# EAGLE design CS42436 Eval (EAGLE 6.3)

## Sheet 1 of 2
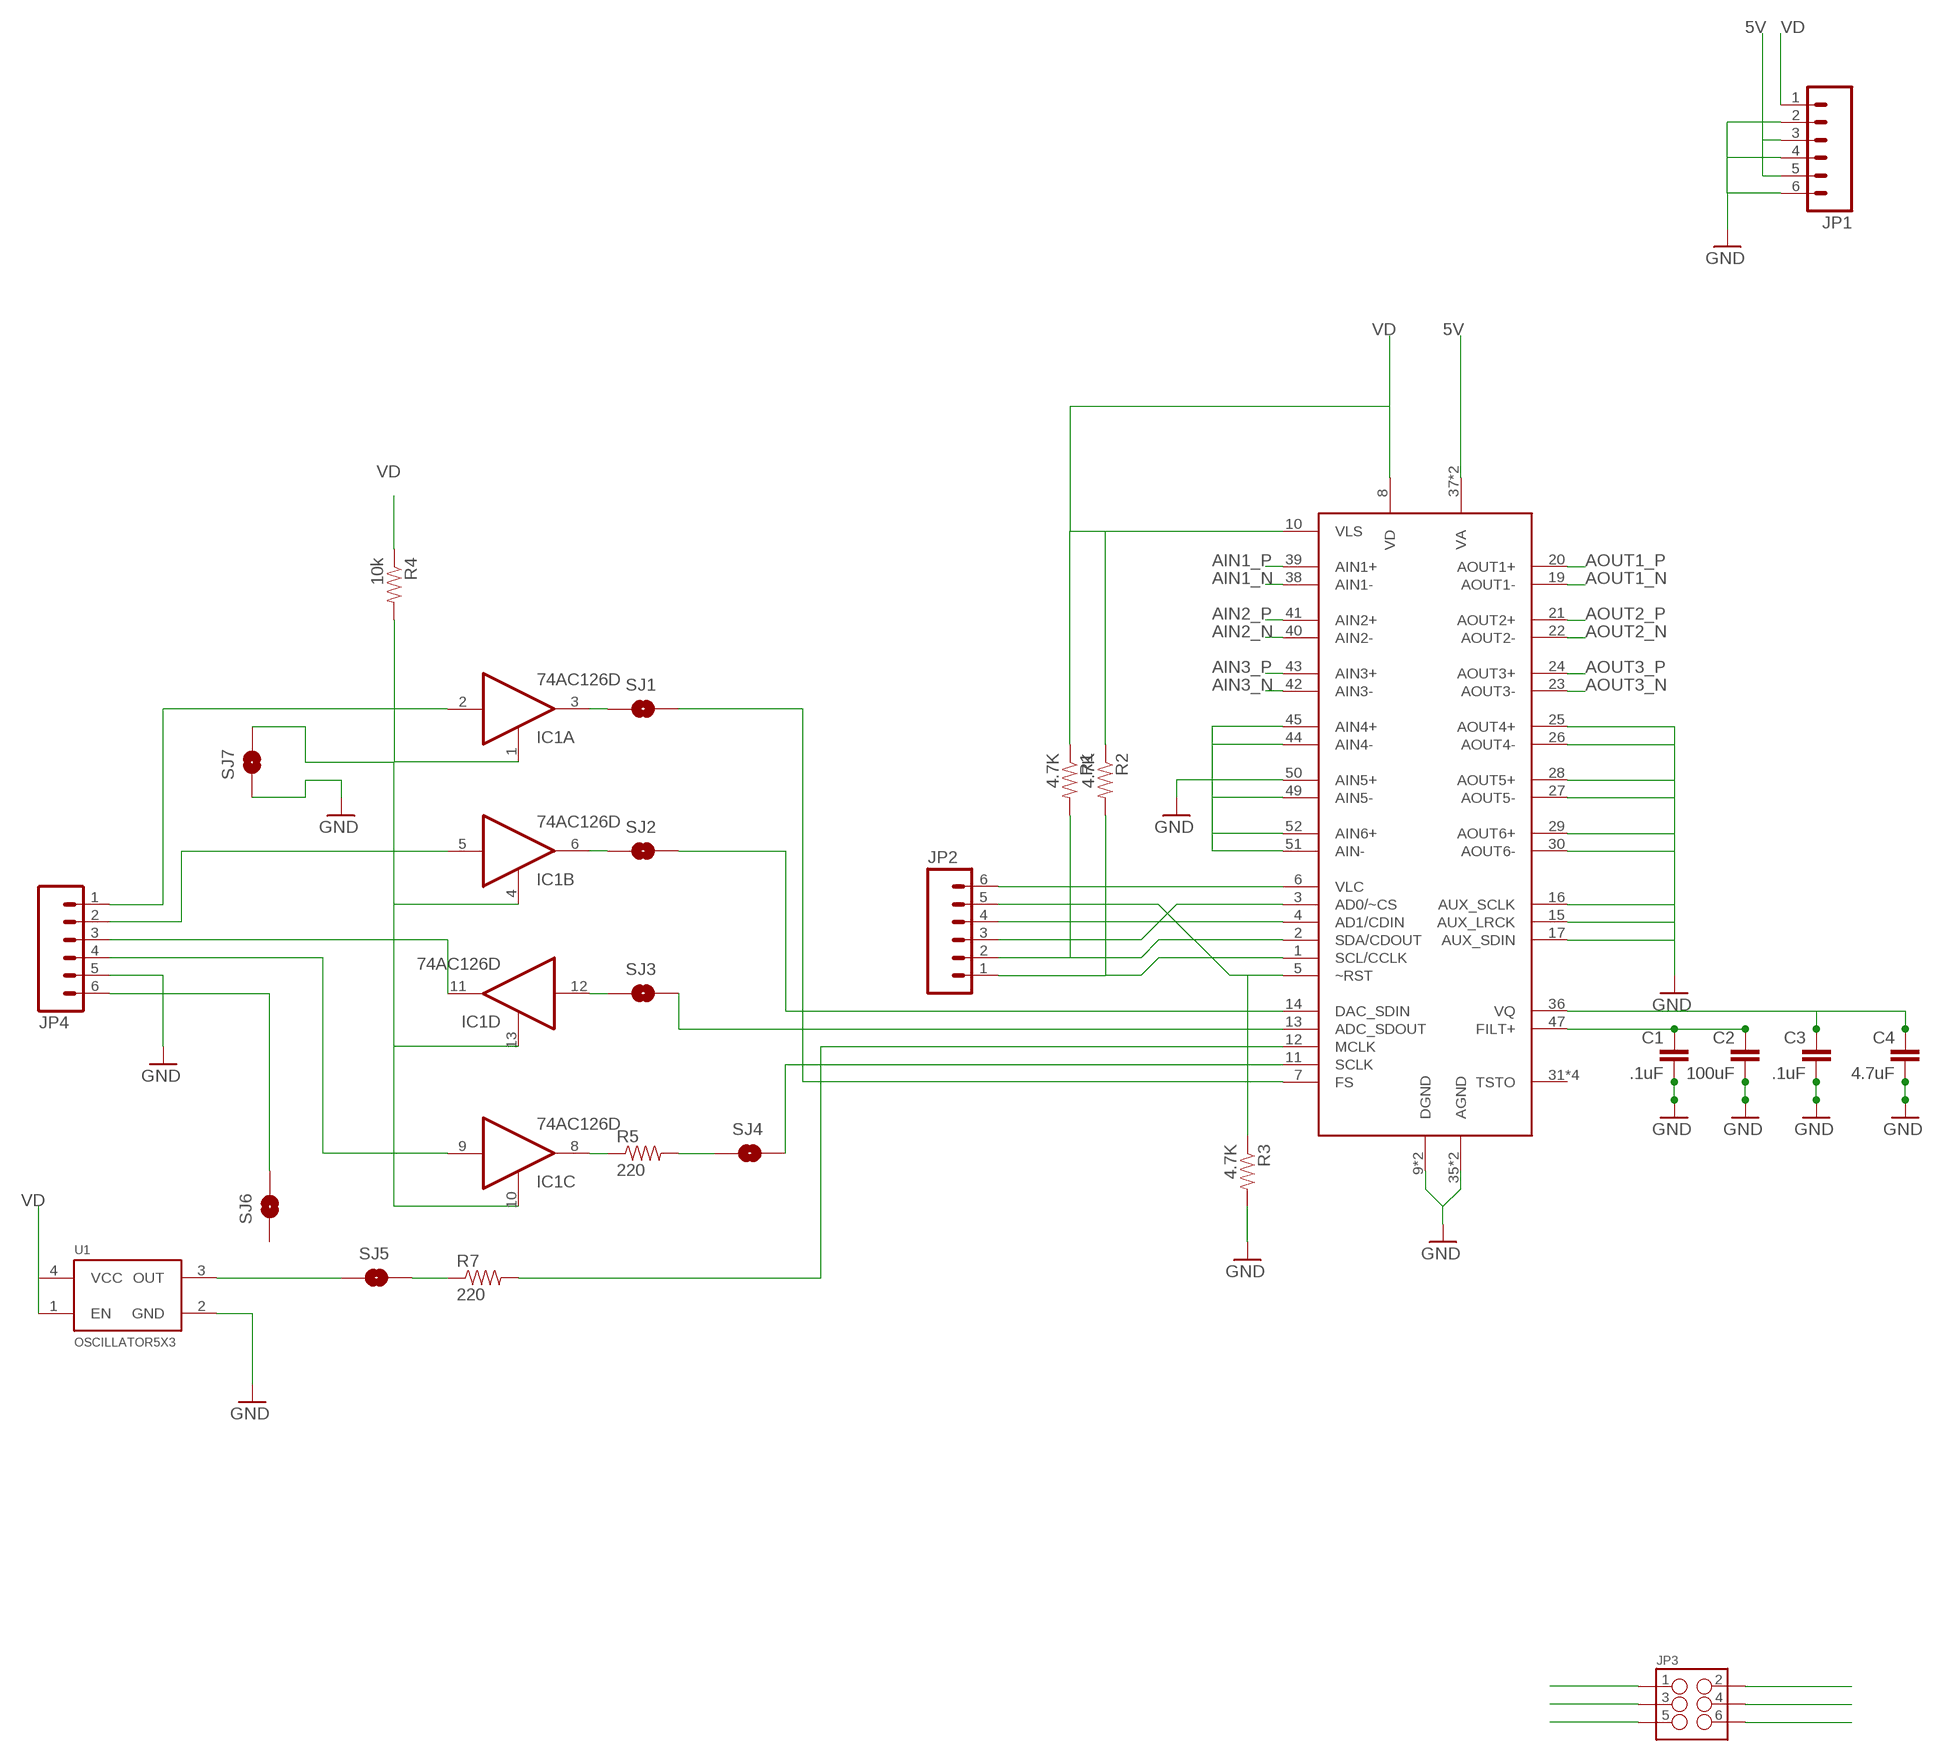
[diagram p0: schematic, sheet 1, part 1 of 2]
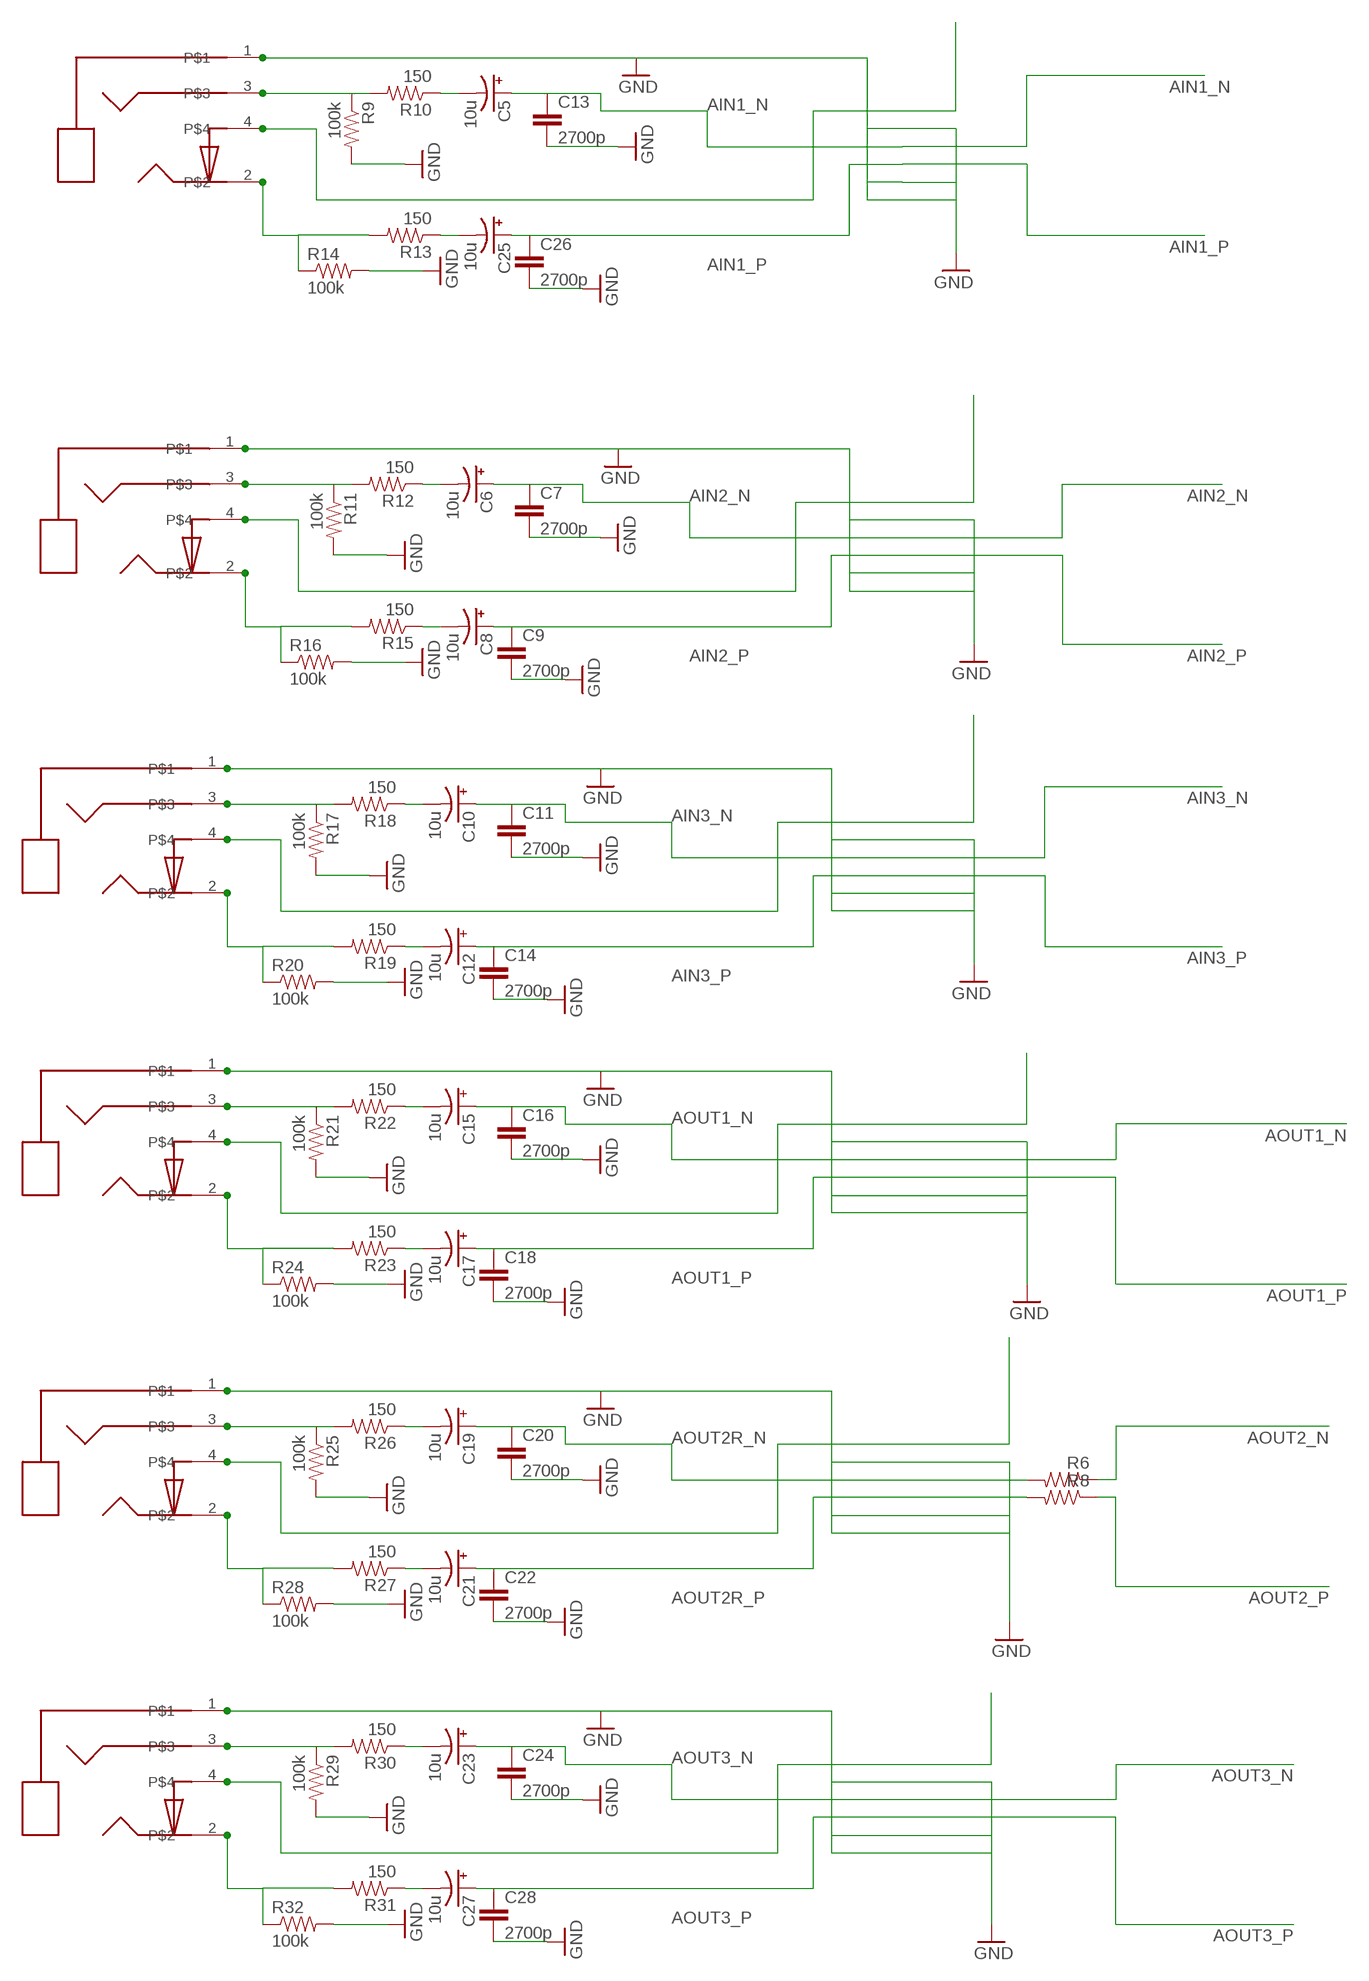
[diagram p1: schematic, sheet 1, part 2 of 2]

### Parts
C1  .1uF  CAP0603-CAP  [0603-CAP]
C2  100uF  CAP1206  [1206]
C3  .1uF  CAP0603-CAP  [0603-CAP]
C4  4.7uF  CAP1206  [1206]
C5  10u  CPOL-USB  [PANASONIC_B]
C6  10u  CPOL-USB  [PANASONIC_B]
C7  2700p  CAP0603-CAP  [0603-CAP]
C8  10u  CPOL-USB  [PANASONIC_B]
C9  2700p  CAP0603-CAP  [0603-CAP]
C10  10u  CPOL-USB  [PANASONIC_B]
C11  2700p  CAP0603-CAP  [0603-CAP]
C12  10u  CPOL-USB  [PANASONIC_B]
C13  2700p  CAP0603-CAP  [0603-CAP]
C14  2700p  CAP0603-CAP  [0603-CAP]
C15  10u  CPOL-USB  [PANASONIC_B]
C16  2700p  CAP0603-CAP  [0603-CAP]
C17  10u  CPOL-USB  [PANASONIC_B]
C18  2700p  CAP0603-CAP  [0603-CAP]
C19  10u  CPOL-USB  [PANASONIC_B]
C20  2700p  CAP0603-CAP  [0603-CAP]
C21  10u  CPOL-USB  [PANASONIC_B]
C22  2700p  CAP0603-CAP  [0603-CAP]
C23  10u  CPOL-USB  [PANASONIC_B]
C24  2700p  CAP0603-CAP  [0603-CAP]
C25  10u  CPOL-USB  [PANASONIC_B]
C26  2700p  CAP0603-CAP  [0603-CAP]
C27  10u  CPOL-USB  [PANASONIC_B]
C28  2700p  CAP0603-CAP  [0603-CAP]
IC1  74AC126D  [SO14]
J1  SJ1-3514-SMT  [SJ1-3514-SMT]
J2  SJ1-3514-SMT  [SJ1-3514-SMT]
J3  SJ1-3514-SMT  [SJ1-3514-SMT]
J4  SJ1-3514-SMT  [SJ1-3514-SMT]
J5  SJ1-3514-SMT  [SJ1-3514-SMT]
J6  SJ1-3514-SMT  [SJ1-3514-SMT]
JP1  M06SMD  [1X06-SMD]
JP2  M06SIP  [1X06]
JP3  M03X2NO_SILK  [2X3-NS]
JP4  M06SIP  [1X06]
R1  4.7K  RESISTOR0603-RES  [0603-RES]
R2  4.7K  RESISTOR0603-RES  [0603-RES]
R3  4.7K  RESISTOR0603-RES  [0603-RES]
R4  10k  RESISTOR0603-RES  [0603-RES]
R5  220  RESISTOR0603-RES  [0603-RES]
R6  RESISTOR1206  [1206]
R7  220  RESISTOR0603-RES  [0603-RES]
R8  RESISTOR1206  [1206]
R9  100k  RESISTOR0603-RES  [0603-RES]
R10  150  RESISTOR0603-RES  [0603-RES]
R11  100k  RESISTOR0603-RES  [0603-RES]
R12  150  RESISTOR0603-RES  [0603-RES]
R13  150  RESISTOR0603-RES  [0603-RES]
R14  100k  RESISTOR0603-RES  [0603-RES]
R15  150  RESISTOR0603-RES  [0603-RES]
R16  100k  RESISTOR0603-RES  [0603-RES]
R17  100k  RESISTOR0603-RES  [0603-RES]
R18  150  RESISTOR0603-RES  [0603-RES]
R19  150  RESISTOR0603-RES  [0603-RES]
R20  100k  RESISTOR0603-RES  [0603-RES]
R21  100k  RESISTOR0603-RES  [0603-RES]
R22  150  RESISTOR0603-RES  [0603-RES]
R23  150  RESISTOR0603-RES  [0603-RES]
R24  100k  RESISTOR0603-RES  [0603-RES]
R25  100k  RESISTOR0603-RES  [0603-RES]
R26  150  RESISTOR0603-RES  [0603-RES]
R27  150  RESISTOR0603-RES  [0603-RES]
R28  100k  RESISTOR0603-RES  [0603-RES]
R29  100k  RESISTOR0603-RES  [0603-RES]
R30  150  RESISTOR0603-RES  [0603-RES]
R31  150  RESISTOR0603-RES  [0603-RES]
R32  100k  RESISTOR0603-RES  [0603-RES]
SJ1  SOLDERJUMPERTRACE  [SJ_2S-TRACE]
SJ2  SOLDERJUMPERTRACE  [SJ_2S-TRACE]
SJ3  SOLDERJUMPERTRACE  [SJ_2S-TRACE]
SJ4  SOLDERJUMPERTRACE  [SJ_2S-TRACE]
SJ5  SOLDERJUMPERTRACE  [SJ_2S-TRACE]
SJ6  SOLDERJUMPERTRACE  [SJ_2S-TRACE]
SJ7  SOLDERJUMPERTRACE  [SJ_2S-TRACE]
U1  OSCILLATOR5X3  [CRYSTAL-SMD-5X3]
U$1  CS42436  [QFP-52]

### Nets
5V: JP1.3 JP1.5 U$1.37(VA) U$1.46(VA)
AIN1_N: C5.+ C13.1 U$1.38(AIN1-)
AIN1_P: C25.+ C26.1 U$1.39(AIN1+)
AIN2_N: C6.+ C7.1 U$1.40(AIN2-)
AIN2_P: C8.+ C9.1 U$1.41(AIN2+)
AIN3_N: C10.+ C11.1 U$1.42(AIN3-)
AIN3_P: C12.+ C14.1 U$1.43(AIN3+)
AOUT1_N: C15.+ C16.1 U$1.19(AOUT1-)
AOUT1_P: C17.+ C18.1 U$1.20(AOUT1+)
AOUT2_N: R6.1 U$1.22(AOUT2-)
AOUT2_P: R8.1 U$1.21(AOUT2+)
AOUT2R_N: C19.+ C20.1 R6.2
AOUT2R_P: C21.+ C22.1 R8.2
AOUT3_N: C23.+ C24.1 U$1.23(AOUT3-)
AOUT3_P: C27.+ C28.1 U$1.24(AOUT3+)
CH1_IN: J1.4 JP3.1
CH1_OUT: J4.4 JP3.2
CH2_IN: J2.4 JP3.3
CH2_OUT: J5.4 JP3.4
CH3_IN: J3.4 JP3.5
CH3_OUT: J6.4 JP3.6
GND: C1.2 C2.2 C3.2 C4.2 C7.2 C9.2 C11.2 C13.2 C14.2 C16.2 C18.2 C20.2 C22.2 C24.2 C26.2 C28.2 J1.1 J2.1 J3.1 J4.1 J5.1 J6.1 JP1.2 JP1.4 JP1.6 JP4.5 R3.2 R9.2 R11.2 R14.2 R16.2 R17.2 R20.2 R21.2 R24.2 R25.2 R28.2 R29.2 R32.2 SJ7.1 U1.2(GND) U$1.9(DGND) U$1.15(AUX_LRCK) U$1.16(AUX_SCLK) U$1.17(AUX_SDIN) U$1.18(DGND) U$1.25(AOUT4+) U$1.26(AOUT4-) U$1.27(AOUT5-) U$1.28(AOUT5+) U$1.29(AOUT6+) U$1.30(AOUT6-) U$1.35(AGND) U$1.44(AIN4-) U$1.45(AIN4+) U$1.48(AGND) U$1.49(AIN5-) U$1.50(AIN5+) U$1.51(AIN-) U$1.52(AIN6+)
N$1: C1.1 C2.1 U$1.47(FILT+)
N$2: C3.1 C4.1 U$1.36(VQ)
N$3: SJ1.2 U$1.7(FS)
N$4: IC1.6(B:O) SJ2.1
N$5: IC1.2(A:I) JP4.1
N$6: IC1.1(A:OE) IC1.4(B:OE) IC1.10(C:OE) IC1.13(D:OE) R4.2 SJ7.2
N$7: R7.1 SJ5.2
N$8: IC1.11(D:O) JP4.3
N$9: IC1.5(B:I) JP4.2
N$10: IC1.12(D:I) SJ3.1
N$11: IC1.3(A:O) SJ1.1
N$12: SJ2.2 U$1.14(DAC_SDIN)
N$13: J1.3 R9.1 R10.2
N$15: SJ3.2 U$1.13(ADC_SDOUT)
N$16: JP2.1 R2.2 U$1.1(SCL/CCLK)
N$18: JP2.2 R1.2 U$1.2(SDA/CDOUT)
N$19: JP2.3 U$1.3(AD0/~CS)
N$20: C5.- R10.1
N$21: JP2.4 U$1.4(AD1/CDIN)
N$22: JP2.5 R3.1 U$1.5(~RST)
N$23: JP2.6 U$1.6(VLC)
N$24: IC1.8(C:O) R5.1
N$25: R5.2 SJ4.1
N$26: SJ4.2 U$1.11(SCLK)
N$27: J2.3 R11.1 R12.2
N$28: C25.- R13.1
N$29: R7.2 U$1.12(MCLK)
N$30: IC1.9(C:I) JP4.4
N$31: SJ5.1 U1.3(OUT)
N$32: JP4.6 SJ6.2
N$34: J1.2 R13.2 R14.1
N$36: C6.- R12.1
N$39: C8.- R15.1
N$40: J2.2 R15.2 R16.1
N$41: J3.3 R17.1 R18.2
N$42: C10.- R18.1
N$43: C12.- R19.1
N$44: J3.2 R19.2 R20.1
N$45: J4.3 R21.1 R22.2
N$46: C15.- R22.1
N$47: C17.- R23.1
N$48: J4.2 R23.2 R24.1
N$49: J5.3 R25.1 R26.2
N$50: C19.- R26.1
N$51: C21.- R27.1
N$52: J5.2 R27.2 R28.1
N$53: J6.3 R29.1 R30.2
N$54: C23.- R30.1
N$55: C27.- R31.1
N$56: J6.2 R31.2 R32.1
VD: JP1.1 R1.1 R2.1 R4.1 U1.1(EN) U1.4(VCC) U$1.8(VD) U$1.10(VLS)
Unconnected: SJ6.1 U$1.31(TSTO) U$1.32(TSTO) U$1.33(TSTO) U$1.34(TSTO)

## Sheet 2 of 2

## Power pins joined to a net without a drawn wire
GND: IC1.7(P:GND)
VCC: IC1.14(P:VCC)

## Library data of the parts
C1 C3 = 1x05smd:CAP: Capacitor Standard 0603 ceramic capacitor, and 0.1" leaded capacitor.
C2 C4 C7 C9 C11 C13 C14 C16 C18 C20 C22 C24 C26 C28 = SparkFun-Passives:CAP: Capacitor Standard 0603 ceramic capacitor, and 0.1" leaded capacitor.
C5 C6 C8 C10 C12 C15 C17 C19 C21 C23 C25 C27 = adafruit:CPOL-US: POLARIZED CAPACITOR, American symbol
IC1 = 74xx-eu:74*126: Quad bus BUFFER, 3-state
J1-J6 = Strutz Electronic Industries:SJ1-3514-SMT
JP1 JP2 JP4 = SparkFun-Connectors:M06: Header 6 Standard 6-pin 0.1" header. Use with straight break away headers (SKU : PRT-00116), right angle break away headers (PRT-00553), swiss pins (PRT-00743), machine pins (PRT-00117), and female headers (PRT-00115). Molex polarized connector foot print use with SKU : PRT-08094 with associated crimp pins and housings. NOTES ON THE VARIANTS LOCK and LOCK_LONGPADS... This footprint was designed to help hold the alignment of a through-hole component (i.e. 6-pin header) while soldering it into place. You may notice that each hole has been shifted either up or down by 0.005 of an inch from it's more standard position (which is a perfectly straight line). This slight alteration caused the pins (the squares in the middle) to touch the edges of the holes. Because they are alternating, it causes a "brace" to hold the component in place. 0.005 has proven to be the perfect amount of "off-center" position when using our standard breakaway headers. Although looks a little odd when you look at the bare footprint, once you have a header in there, the alteration is very hard to notice. Also,if you push a header all the way into place, it is covered up entirely on the bottom side. This idea of altering the position of holes to aid alignment will be further integrated into the Sparkfun Library for other footprints. It can help hold any component with 3 or more connection pins.
JP3 = SparkFun-Connectors:M03X2: 2x3 .1" header. Shrouded, with keying- CONN-10681 SMT- CONN-11415 Pogo pins- HW-11044
R1-R32 = SparkFun-Passives:RESISTOR: Resistor Basic schematic elements and footprints for 0603, 1206, and PTH resistors.
SJ1-SJ7 = 1x05smd:SOLDERJUMPER: Solder Jumper Standard SMD solder jumper. Used to automate production. Two varients : Normally Open and Normally Closed are the same, but have different paste layers. NC will have a large amount of paste and should jumper during reflow.
U1 = SparkFun-FreqCtrl:OSCILLATOR: Generic 5x3 and 7x5 oscillators
U$1 = Strutz Electronic Industries:CS42436

## Board
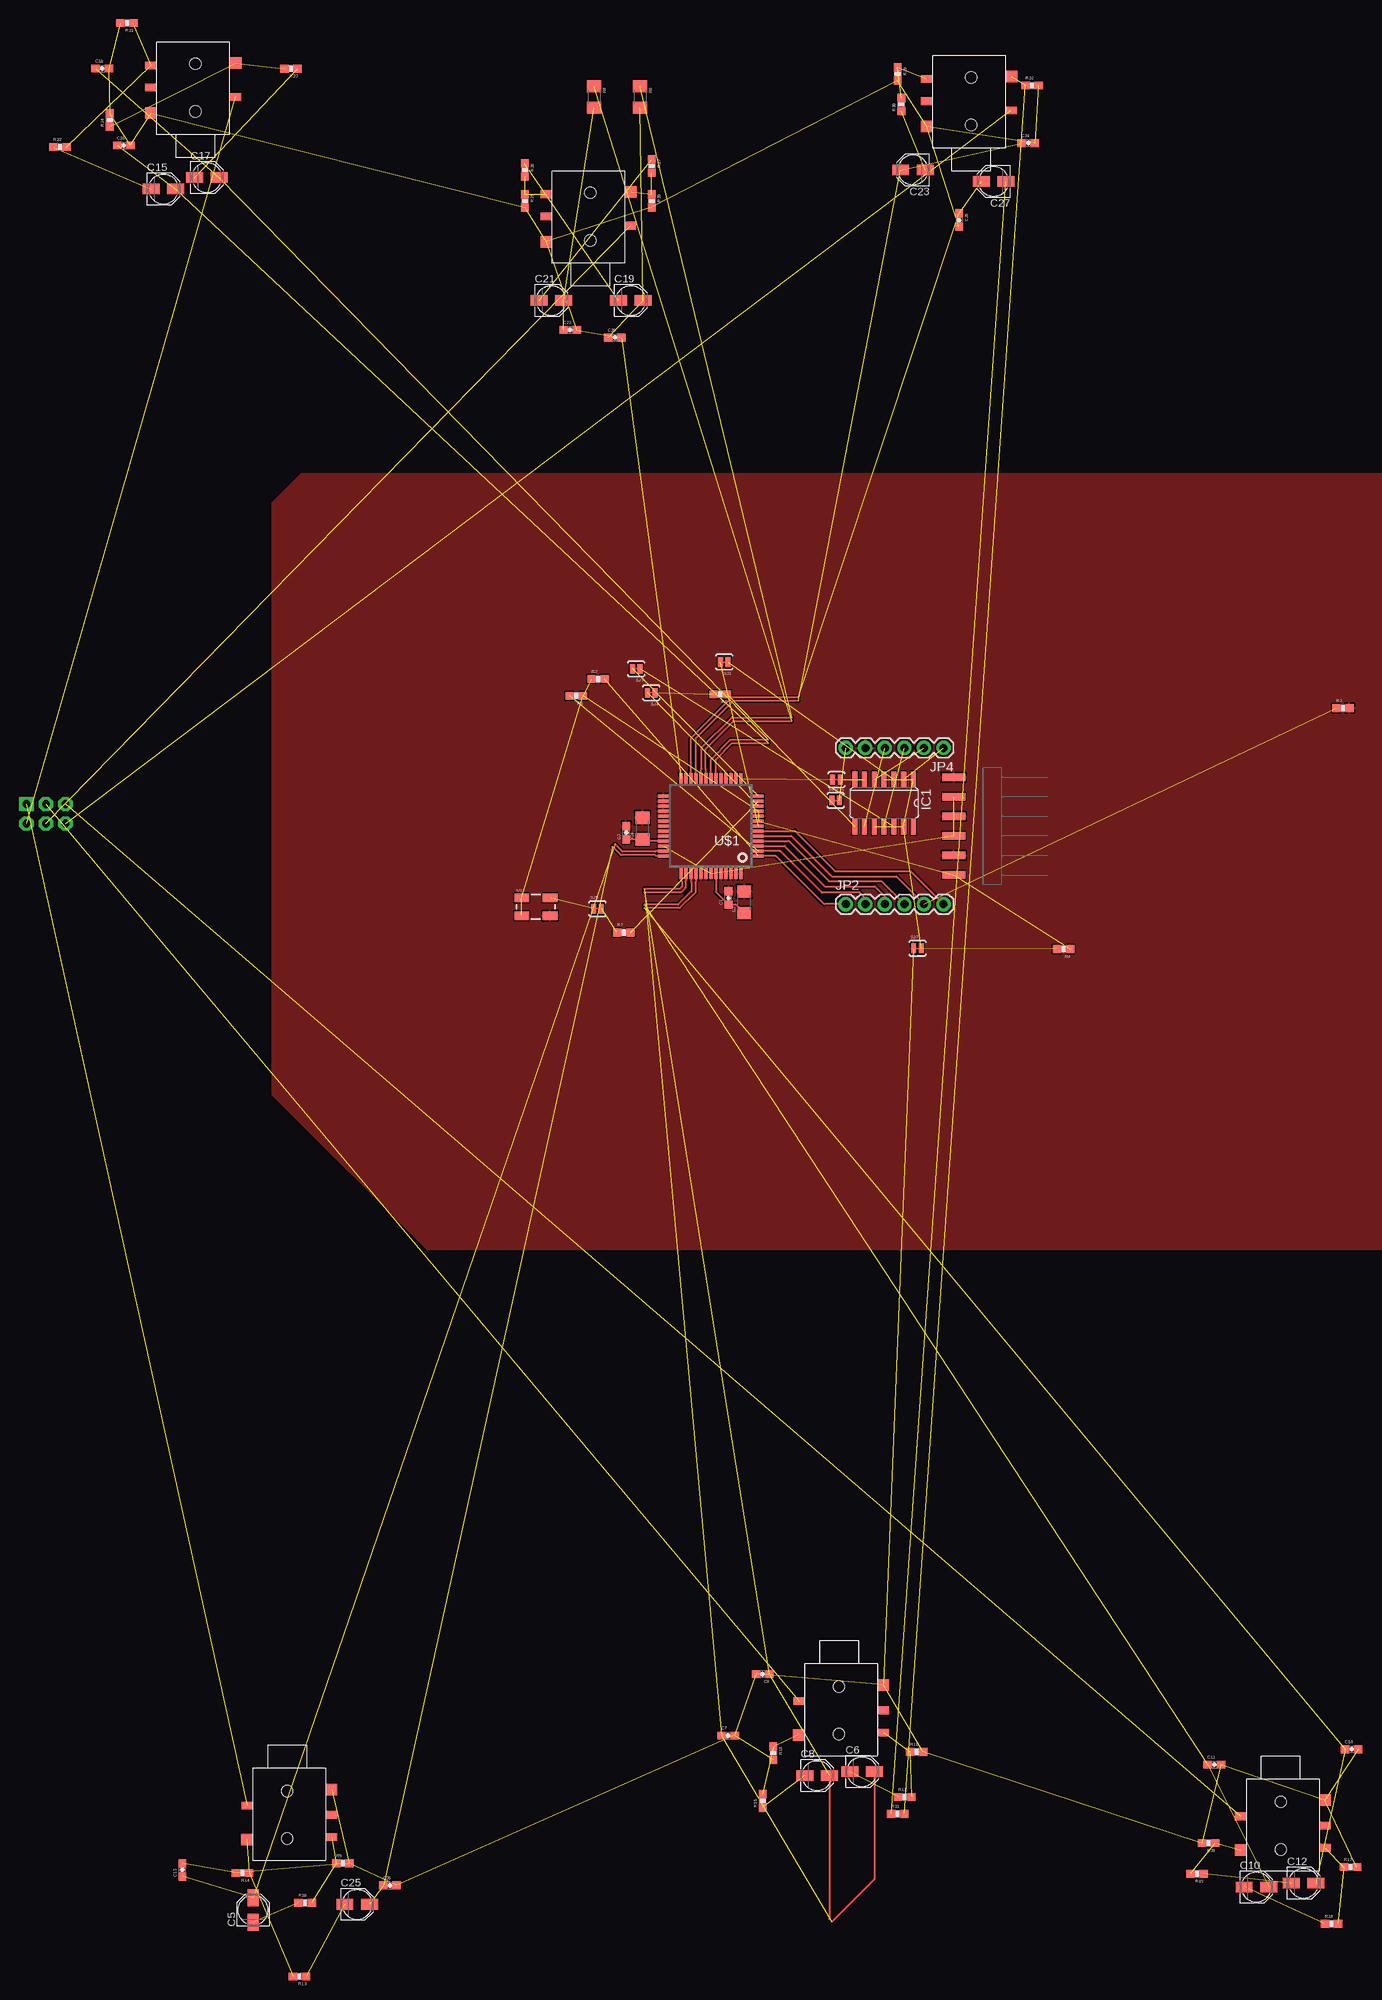
[diagram p2: board, top side]

No outline drawn. Coordinates in mm, seen from the top.
Copper layers (1*16): Top 0.035mm / dielectric 1.5mm / Bottom 0.035mm
Design rules "default": minimum track width 10mil, minimum drill 24mil, track to track 8mil, track to pad 8mil, pad to pad 8mil, via to via 8mil, smd to smd 8mil, copper to edge 40mil, drill to drill 8mil, minimum pad ring 10mil, minimum via ring 8mil, stop-mask expansion 4mil, vias tented up to drill 0mil, thermal gap 10mil

### Footprints (pad centres in the part's own frame; a part is rotated, then mirrored left to right if it is on the bottom)
0603-CAP = smd 1.1 x 1: 1 -0.85,0; 2 0.85,0
1206 = smd 1.6 x 1.8: 1 -1.4,0; 2 1.4,0
PANASONIC_B = smd 2.2 x 1.4: + 1.6,0; - -1.6,0
SO14 = smd 0.66 x 2.032: 1 -3.81,-3.073; 2 -2.54,-3.073; 3 -1.27,-3.073; 4 0,-3.073; 5 1.27,-3.073; 6 2.54,-3.073; 7 3.81,-3.073; 8 3.81,3.073; 9 2.54,3.073; 10 1.27,3.073; 11 0,3.073; 12 -1.27,3.073; 13 -2.54,3.073; 14 -3.81,3.073
SJ1-3514-SMT = smd 1.5 x 1.5: 1 -5.39,-2.97; 2 5.61,3.53 | smd 1.5 x 1: 3 -5.39,3.23; 4 5.56,-0.87; 5 -5.39,0.33 | hole 1.5: 0.36,-2.77; 0.36,3.43
1X06-SMD = smd 1 x 3: 1 -6.35,5; 2 -3.81,5; 3 -1.27,5; 4 1.27,5; 5 3.81,5; 6 6.35,5
1X06 = drill 1.016 pad 1.88: 1 0,0; 2 2.54,0; 3 5.08,0; 4 7.62,0; 5 10.16,0; 6 12.7,0
2X3-NS = drill 1.016 pad 1.88 square: 1 -2.54,-1.27 | drill 1.016 pad 1.88 octagon: 2 -2.54,1.27; 3 0,-1.27; 4 0,1.27; 5 2.54,-1.27; 6 2.54,1.27
0603-RES = smd 1.1 x 1: 1 -0.85,0; 2 0.85,0
SJ_2S-TRACE = smd 0.635 x 1.27: 1 -0.508,0; 2 0.508,0
CRYSTAL-SMD-5X3 = smd 1.9 x 1.1: 1 -1.85,-1.15; 2 1.85,-1.15; 3 1.85,1.15; 4 -1.85,1.15
QFP-52 = smd 1.4 x 0.4: 1 -6.175,3.9; 2 -6.175,3.25; 3 -6.175,2.6; 4 -6.175,1.95; 5 -6.175,1.3; 6 -6.175,0.65; 7 -6.175,0; 8 -6.175,-0.65; 9 -6.175,-1.3; 10 -6.175,-1.95; 11 -6.175,-2.6; 12 -6.175,-3.25; 13 -6.175,-3.9; 27 6.175,-3.9; 28 6.175,-3.25; 29 6.175,-2.6; 30 6.175,-1.95; 31 6.175,-1.3; 32 6.175,-0.65; 33 6.175,0; 34 6.175,0.65; 35 6.175,1.3; 36 6.175,1.95; 37 6.175,2.6; 38 6.175,3.25; 39 6.175,3.9 | smd 0.4 x 1.4: 14 -3.9,-6.175; 15 -3.25,-6.175; 16 -2.6,-6.175; 17 -1.95,-6.175; 18 -1.3,-6.175; 19 -0.65,-6.175; 20 0,-6.175; 21 0.65,-6.175; 22 1.3,-6.175; 23 1.95,-6.175; 24 2.6,-6.175; 25 3.25,-6.175; 26 3.9,-6.175; 40 3.9,6.175; 41 3.25,6.175; 42 2.6,6.175; 43 1.95,6.175; 44 1.3,6.175; 45 0.65,6.175; 46 0,6.175; 47 -0.65,6.175; 48 -1.3,6.175; 49 -1.95,6.175; 50 -2.6,6.175; 51 -3.25,6.175; 52 -3.9,6.175

### Placement (x,y rotation side)
C1  5.05,0.8 90 top
C2  7.1,0.25 90 top
C3  -8.25,9.3 90 top
C4  -6.15,9.85 90 top
C5  -56.79,-130.87 90 top
C6  22.43,-112.86 0 top
C7  5,-108.15 0 top
C8  16.58,-113.36 0 top
C9  9.5,-100.15 180 top
C10  73.73,-127.86 0 top
C11  68.26,-111.95 0 top
C12  79.88,-127.36 0 top
C13  -66,-125.65 90 top
C14  86.14,-109.95 0 top
C15  -68.46,93.03 0 top
C16  -73.62,98.7 0 top
C17  -62.81,94.53 0 top
C18  -76.43,108.7 0 top
C19  -7.66,78.53 0 top
C20  -9.74,73.7 0 top
C21  -18.01,78.53 0 top
C22  -15.55,74.7 0 top
C23  29.05,95.5 180 top
C24  44.05,99 0 top
C25  -43.26,-130.12 0 top
C26  -39,-127.65 0 top
C27  39.55,94 180 top
C28  35.05,89 270 top
IC1  25.3,13.15 180 top
J1  -52,-118.15 180 top
J2  19.79,-104.54 180 top
J3  77.26,-119.54 180 top
J4  -64.68,105.89 0 top
J5  -13.27,89.13 0 top
J6  36.26,104.13 0 top
JP1  39.37,10.16 90 top
JP2  20.32,0 0 top
JP3  -83.75,11.75 180 bottom
JP4  33.02,20.32 180 top
R1  -14.75,27.1 180 top
R2  -11.9,29.3 0 top
R3  85,25.5 0 top
R4  48.65,-5.85 180 top
R5  4,27.3 180 top
R6  -6.45,105 270 top
R7  -8.57,-3.69 0 top
R8  -12.45,105 270 top
R9  -45.13,-124.77 0 top
R10  -50.03,-129.92 0 top
R11  29.52,-110.27 0 top
R12  28,-116.15 0 top
R13  -50.75,-139.5 180 top
R14  -58.17,-126.03 180 top
R15  9.5,-116.65 90 top
R16  10.88,-110.47 270 top
R17  85.97,-125.27 0 top
R18  83.5,-132.65 0 top
R19  66,-126.15 180 top
R20  67.5,-122.15 180 top
R21  -73.22,114.62 180 top
R22  -81.95,98.5 0 top
R23  -51.86,108.69 180 top
R24  -75.45,102 90 top
R25  -21.45,91.5 270 top
R26  -21.45,95.5 270 top
R27  -4.95,96 270 top
R28  -4.95,91.5 270 top
R29  27.05,108 270 top
R30  27.55,104 90 top
R31  27.09,-118.34 0 top
R32  44.55,106.5 0 top
SJ1  4.5,31.5 180 top
SJ2  19.1,16.2 180 top
SJ3  -6.95,30.61 180 top
SJ4  -5,27.5 180 top
SJ5  -12,-0.6 0 top
SJ6  19,13.5 0 top
SJ7  29.65,-5.75 0 top
U1  -20.01,-0.35 0 top
U$1  2.76,10.16 180 top

### Tracks (layer width: path | path; a pad name or v marks a point on that pad's centre or on a via)
5V  (3 unrouted)
AIN1_N  (2 unrouted)
  Top 0.254: U$1.38 -4.42,6.91 -4.5,6.83 -8.76,6.83 -9.74,7.81
AIN1_P  (2 unrouted)
  Top 0.254: U$1.39 -4.39,6.26 -4.5,6.37 -8.95,6.37 -10.06,7.49
AIN2_N  (2 unrouted)
  Top 0.254: C6.+ 24.03,-126.84 18.51,-132.36 | U$1.40 -1.14,3.06 -1.03,2.95 -1.03,2.29 -1.34,1.98 -5.9,1.98
AIN2_P  (2 unrouted)
  Top 0.254: C8.+ 18.18,-132.03 18.19,-132.04 | U$1.41 -0.49,3.03 -0.57,2.95 -0.57,2.1 -1.16,1.52 -5.9,1.52
AIN3_N  (2 unrouted)
  Top 0.254: U$1.42 0.16,2.96 0.27,2.85 0.27,1.7 -1.5,-0.07 -5.9,-0.07
AIN3_P  (2 unrouted)
  Top 0.254: U$1.43 0.81,2.93 0.73,2.85 0.73,1.5 -1.3,-0.53 -5.9,-0.53
AOUT1_N  (2 unrouted)
  Top 0.254: U$1.19 3.41,18.84 5.5,20.92 10.25,20.92
AOUT1_P  (2 unrouted)
  Top 0.254: U$1.20 2.76,18.83 5.3,21.38 10.25,21.38
AOUT2_N  (1 unrouted)
  Top 0.254: U$1.22 1.46,17.49 1.57,17.6 1.57,20.34 5.5,24.28 13.3,24.28
AOUT2_P  (1 unrouted)
  Top 0.254: U$1.21 2.11,17.52 2.03,17.6 2.03,20.16 5.7,23.82 13.3,23.82
AOUT2R_N  (2 unrouted)
AOUT2R_P  (2 unrouted)
AOUT3_N  (2 unrouted)
  Top 0.254: U$1.23 0.81,21.59 5.7,26.47 14.15,26.47
AOUT3_P  (2 unrouted)
  Top 0.254: U$1.24 0.16,21.58 5.5,26.93 14.15,26.93
CH1_IN  (1 unrouted)
CH1_OUT  (1 unrouted)
CH2_IN  (1 unrouted)
CH2_OUT  (1 unrouted)
CH3_IN  (1 unrouted)
CH3_OUT  (1 unrouted)
GND  (30 unrouted)
  pour Top: -49.3,56 110.4,56 116.5,49.9 116.5,-38.1 109.65,-44.95 -34.1,-44.95 -54.25,-24.8 -54.25,52.25 -50.5,56
N$1
  Top 0.254: U$1.47 3.41,1.59 C1.1 6,-0.05 C2.1
N$2
  Top 0.254: U$1.36 -5.91,8.21 C4.1 C3.1
N$3  (1 unrouted)
N$4  (1 unrouted)
N$5  (1 unrouted)
N$6  (5 unrouted)
N$7  (1 unrouted)
N$8  (1 unrouted)
N$9  (1 unrouted)
N$10  (1 unrouted)
N$11  (1 unrouted)
N$12  (1 unrouted)
N$13  (2 unrouted)
N$15  (1 unrouted)
N$16  (1 unrouted)
  Top 0.254: JP2.1 17.5,0 11.25,6.25 8.95,6.25 U$1.1
N$18  (1 unrouted)
  Top 0.254: JP2.2 22.86,0.74 22.1,1.5 17.2,1.5 11.8,6.9 8.95,6.9 U$1.2
N$19
  Top 0.254: JP2.3 25.4,1 24.1,2.3 17.6,2.3 12.34,7.56 U$1.3
N$20  (1 unrouted)
N$21
  Top 0.254: U$1.4 12.89,8.21 18.1,3 24.94,3 JP2.4
N$22  (1 unrouted)
  Top 0.254: U$1.5 13.24,8.86 18.5,3.6 26.88,3.6 JP2.5
N$23
  Top 0.254: U$1.6 13.69,9.51 18.9,4.3 28.72,4.3 JP2.6
N$24  (1 unrouted)
N$25  (1 unrouted)
N$26  (1 unrouted)
N$27  (2 unrouted)
N$28  (1 unrouted)
N$29  (1 unrouted)
N$30  (1 unrouted)
N$31  (1 unrouted)
N$32  (1 unrouted)
N$34  (2 unrouted)
N$36  (1 unrouted)
N$39  (1 unrouted)
N$40  (2 unrouted)
N$41  (2 unrouted)
N$42  (1 unrouted)
N$43  (1 unrouted)
N$44  (2 unrouted)
N$45  (2 unrouted)
N$46  (1 unrouted)
N$47  (1 unrouted)
N$48  (2 unrouted)
N$49  (2 unrouted)
N$50  (1 unrouted)
N$51  (1 unrouted)
N$52  (2 unrouted)
N$53  (2 unrouted)
N$54  (1 unrouted)
N$55  (1 unrouted)
N$56  (2 unrouted)
VD  (7 unrouted)